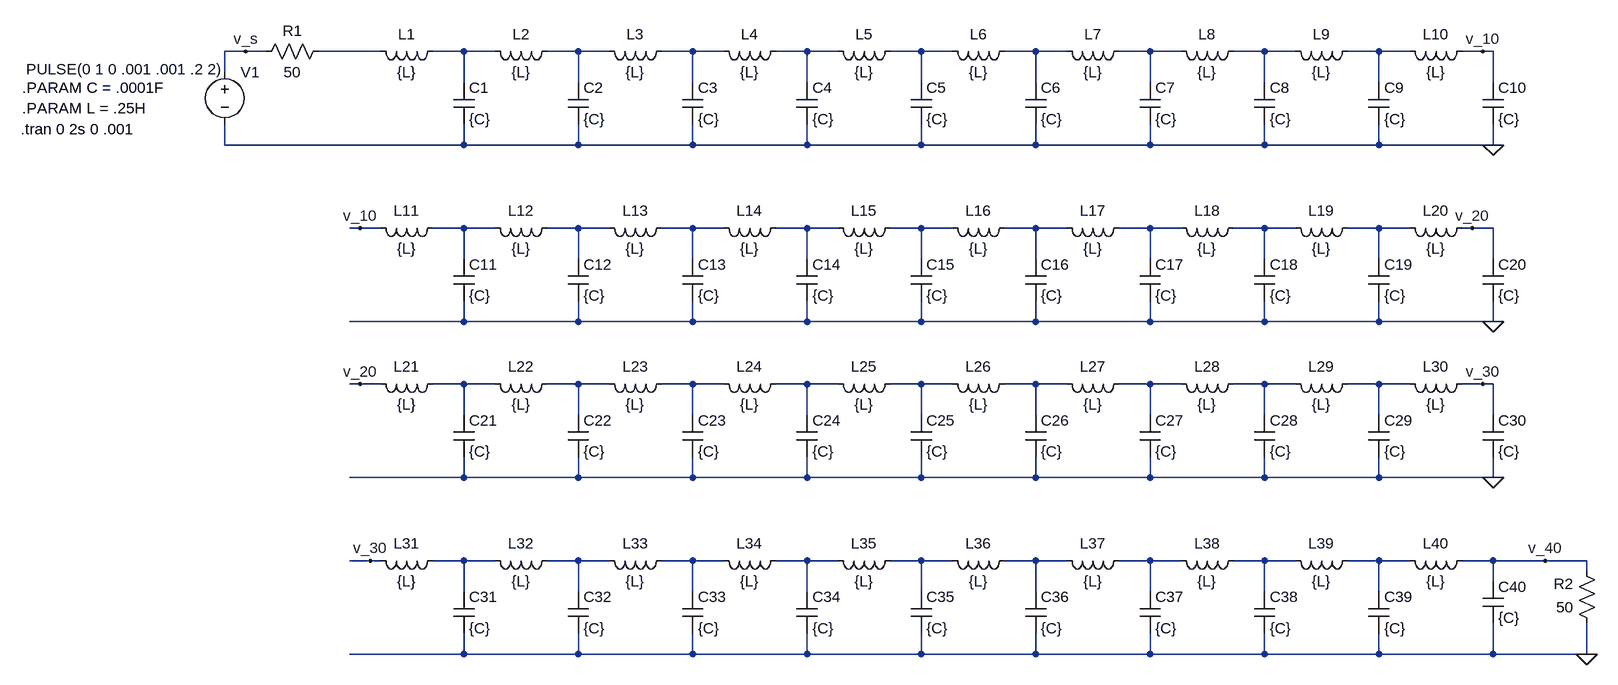
[diagram p0: schematic Schematic.asc]
Schematic.asc, the LTspice schematic file:
Version 4
SHEET 1 1844 1016
WIRE -240 48 -272 48
WIRE -208 48 -240 48
WIRE -32 48 -128 48
WIRE 96 48 48 48
WIRE 144 48 96 48
WIRE 272 48 224 48
WIRE 320 48 272 48
WIRE 448 48 400 48
WIRE 496 48 448 48
WIRE 624 48 576 48
WIRE 672 48 624 48
WIRE 800 48 752 48
WIRE 848 48 800 48
WIRE 976 48 928 48
WIRE 1024 48 976 48
WIRE 1152 48 1104 48
WIRE 1200 48 1152 48
WIRE 1328 48 1280 48
WIRE 1376 48 1328 48
WIRE 1504 48 1456 48
WIRE 1552 48 1504 48
WIRE 1664 48 1632 48
WIRE 1680 48 1664 48
WIRE -272 80 -272 48
WIRE 96 96 96 48
WIRE 272 96 272 48
WIRE 448 96 448 48
WIRE 624 96 624 48
WIRE 800 96 800 48
WIRE 976 96 976 48
WIRE 1152 96 1152 48
WIRE 1328 96 1328 48
WIRE 1504 96 1504 48
WIRE 1680 96 1680 48
WIRE -272 192 -272 160
WIRE 96 192 96 160
WIRE 96 192 -272 192
WIRE 272 192 272 160
WIRE 272 192 96 192
WIRE 448 192 448 160
WIRE 448 192 272 192
WIRE 624 192 624 160
WIRE 624 192 448 192
WIRE 800 192 800 160
WIRE 800 192 624 192
WIRE 976 192 976 160
WIRE 976 192 800 192
WIRE 1152 192 1152 160
WIRE 1152 192 976 192
WIRE 1328 192 1328 160
WIRE 1328 192 1152 192
WIRE 1504 192 1504 160
WIRE 1504 192 1328 192
WIRE 1680 192 1680 160
WIRE 1680 192 1504 192
WIRE -64 320 -80 320
WIRE -32 320 -64 320
WIRE 96 320 48 320
WIRE 144 320 96 320
WIRE 272 320 224 320
WIRE 320 320 272 320
WIRE 448 320 400 320
WIRE 496 320 448 320
WIRE 624 320 576 320
WIRE 672 320 624 320
WIRE 800 320 752 320
WIRE 848 320 800 320
WIRE 976 320 928 320
WIRE 1024 320 976 320
WIRE 1152 320 1104 320
WIRE 1200 320 1152 320
WIRE 1328 320 1280 320
WIRE 1376 320 1328 320
WIRE 1504 320 1456 320
WIRE 1552 320 1504 320
WIRE 1648 320 1632 320
WIRE 1680 320 1648 320
WIRE 96 368 96 320
WIRE 272 368 272 320
WIRE 448 368 448 320
WIRE 624 368 624 320
WIRE 800 368 800 320
WIRE 976 368 976 320
WIRE 1152 368 1152 320
WIRE 1328 368 1328 320
WIRE 1504 368 1504 320
WIRE 1680 368 1680 320
WIRE 96 464 96 432
WIRE 96 464 -80 464
WIRE 272 464 272 432
WIRE 272 464 96 464
WIRE 448 464 448 432
WIRE 448 464 272 464
WIRE 624 464 624 432
WIRE 624 464 448 464
WIRE 800 464 800 432
WIRE 800 464 624 464
WIRE 976 464 976 432
WIRE 976 464 800 464
WIRE 1152 464 1152 432
WIRE 1152 464 976 464
WIRE 1328 464 1328 432
WIRE 1328 464 1152 464
WIRE 1504 464 1504 432
WIRE 1504 464 1328 464
WIRE 1680 464 1680 432
WIRE 1680 464 1504 464
WIRE -64 560 -80 560
WIRE -32 560 -64 560
WIRE 96 560 48 560
WIRE 144 560 96 560
WIRE 272 560 224 560
WIRE 320 560 272 560
WIRE 448 560 400 560
WIRE 496 560 448 560
WIRE 624 560 576 560
WIRE 672 560 624 560
WIRE 800 560 752 560
WIRE 848 560 800 560
WIRE 976 560 928 560
WIRE 1024 560 976 560
WIRE 1152 560 1104 560
WIRE 1200 560 1152 560
WIRE 1328 560 1280 560
WIRE 1376 560 1328 560
WIRE 1504 560 1456 560
WIRE 1552 560 1504 560
WIRE 1664 560 1632 560
WIRE 1680 560 1664 560
WIRE 96 608 96 560
WIRE 272 608 272 560
WIRE 448 608 448 560
WIRE 624 608 624 560
WIRE 800 608 800 560
WIRE 976 608 976 560
WIRE 1152 608 1152 560
WIRE 1328 608 1328 560
WIRE 1504 608 1504 560
WIRE 1680 608 1680 560
WIRE 96 704 96 672
WIRE 96 704 -80 704
WIRE 272 704 272 672
WIRE 272 704 96 704
WIRE 448 704 448 672
WIRE 448 704 272 704
WIRE 624 704 624 672
WIRE 624 704 448 704
WIRE 800 704 800 672
WIRE 800 704 624 704
WIRE 976 704 976 672
WIRE 976 704 800 704
WIRE 1152 704 1152 672
WIRE 1152 704 976 704
WIRE 1328 704 1328 672
WIRE 1328 704 1152 704
WIRE 1504 704 1504 672
WIRE 1504 704 1328 704
WIRE 1680 704 1680 672
WIRE 1680 704 1504 704
WIRE -48 832 -80 832
WIRE -32 832 -48 832
WIRE 96 832 48 832
WIRE 144 832 96 832
WIRE 272 832 224 832
WIRE 320 832 272 832
WIRE 448 832 400 832
WIRE 496 832 448 832
WIRE 624 832 576 832
WIRE 672 832 624 832
WIRE 800 832 752 832
WIRE 848 832 800 832
WIRE 976 832 928 832
WIRE 1024 832 976 832
WIRE 1152 832 1104 832
WIRE 1200 832 1152 832
WIRE 1328 832 1280 832
WIRE 1376 832 1328 832
WIRE 1504 832 1456 832
WIRE 1552 832 1504 832
WIRE 1680 832 1632 832
WIRE 1760 832 1680 832
WIRE 1824 832 1760 832
WIRE 1824 848 1824 832
WIRE 1680 864 1680 832
WIRE 96 880 96 832
WIRE 272 880 272 832
WIRE 448 880 448 832
WIRE 624 880 624 832
WIRE 800 880 800 832
WIRE 976 880 976 832
WIRE 1152 880 1152 832
WIRE 1328 880 1328 832
WIRE 1504 880 1504 832
WIRE 96 976 96 944
WIRE 96 976 -80 976
WIRE 272 976 272 944
WIRE 272 976 96 976
WIRE 448 976 448 944
WIRE 448 976 272 976
WIRE 624 976 624 944
WIRE 624 976 448 976
WIRE 800 976 800 944
WIRE 800 976 624 976
WIRE 976 976 976 944
WIRE 976 976 800 976
WIRE 1152 976 1152 944
WIRE 1152 976 976 976
WIRE 1328 976 1328 944
WIRE 1328 976 1152 976
WIRE 1504 976 1504 944
WIRE 1504 976 1328 976
WIRE 1680 976 1680 928
WIRE 1680 976 1504 976
WIRE 1824 976 1824 928
WIRE 1824 976 1680 976
FLAG 1680 192 0
FLAG 1680 464 0
FLAG 1680 704 0
FLAG 1824 976 0
FLAG -240 48 v_s
FLAG 1664 48 v_10
FLAG -64 320 v_10
FLAG 1648 320 v_20
FLAG -64 560 v_20
FLAG 1664 560 v_30
FLAG -48 832 v_30
FLAG 1760 832 v_40
SYMBOL ind 64 32 R90
WINDOW 0 5 56 VBottom 2
WINDOW 3 32 56 VTop 2
SYMATTR InstName L1
SYMATTR Value {L}
SYMBOL cap 80 96 R0
SYMATTR InstName C1
SYMATTR Value {C}
SYMBOL ind 240 32 R90
WINDOW 0 5 56 VBottom 2
WINDOW 3 32 56 VTop 2
SYMATTR InstName L2
SYMATTR Value {L}
SYMBOL cap 256 96 R0
SYMATTR InstName C2
SYMATTR Value {C}
SYMBOL ind 416 32 R90
WINDOW 0 5 56 VBottom 2
WINDOW 3 32 56 VTop 2
SYMATTR InstName L3
SYMATTR Value {L}
SYMBOL cap 432 96 R0
SYMATTR InstName C3
SYMATTR Value {C}
SYMBOL ind 592 32 R90
WINDOW 0 5 56 VBottom 2
WINDOW 3 32 56 VTop 2
SYMATTR InstName L4
SYMATTR Value {L}
SYMBOL cap 608 96 R0
SYMATTR InstName C4
SYMATTR Value {C}
SYMBOL ind 768 32 R90
WINDOW 0 5 56 VBottom 2
WINDOW 3 32 56 VTop 2
SYMATTR InstName L5
SYMATTR Value {L}
SYMBOL cap 784 96 R0
SYMATTR InstName C5
SYMATTR Value {C}
SYMBOL ind 944 32 R90
WINDOW 0 5 56 VBottom 2
WINDOW 3 32 56 VTop 2
SYMATTR InstName L6
SYMATTR Value {L}
SYMBOL cap 960 96 R0
SYMATTR InstName C6
SYMATTR Value {C}
SYMBOL ind 1120 32 R90
WINDOW 0 5 56 VBottom 2
WINDOW 3 32 56 VTop 2
SYMATTR InstName L7
SYMATTR Value {L}
SYMBOL cap 1136 96 R0
SYMATTR InstName C7
SYMATTR Value {C}
SYMBOL ind 1296 32 R90
WINDOW 0 5 56 VBottom 2
WINDOW 3 32 56 VTop 2
SYMATTR InstName L8
SYMATTR Value {L}
SYMBOL cap 1312 96 R0
SYMATTR InstName C8
SYMATTR Value {C}
SYMBOL ind 1472 32 R90
WINDOW 0 5 56 VBottom 2
WINDOW 3 32 56 VTop 2
SYMATTR InstName L9
SYMATTR Value {L}
SYMBOL cap 1488 96 R0
SYMATTR InstName C9
SYMATTR Value {C}
SYMBOL ind 1648 32 R90
WINDOW 0 5 56 VBottom 2
WINDOW 3 32 56 VTop 2
SYMATTR InstName L10
SYMATTR Value {L}
SYMBOL cap 1664 96 R0
SYMATTR InstName C10
SYMATTR Value {C}
SYMBOL ind 64 304 R90
WINDOW 0 5 56 VBottom 2
WINDOW 3 32 56 VTop 2
SYMATTR InstName L11
SYMATTR Value {L}
SYMBOL cap 80 368 R0
SYMATTR InstName C11
SYMATTR Value {C}
SYMBOL ind 240 304 R90
WINDOW 0 5 56 VBottom 2
WINDOW 3 32 56 VTop 2
SYMATTR InstName L12
SYMATTR Value {L}
SYMBOL cap 256 368 R0
SYMATTR InstName C12
SYMATTR Value {C}
SYMBOL ind 416 304 R90
WINDOW 0 5 56 VBottom 2
WINDOW 3 32 56 VTop 2
SYMATTR InstName L13
SYMATTR Value {L}
SYMBOL cap 432 368 R0
SYMATTR InstName C13
SYMATTR Value {C}
SYMBOL ind 592 304 R90
WINDOW 0 5 56 VBottom 2
WINDOW 3 32 56 VTop 2
SYMATTR InstName L14
SYMATTR Value {L}
SYMBOL cap 608 368 R0
SYMATTR InstName C14
SYMATTR Value {C}
SYMBOL ind 768 304 R90
WINDOW 0 5 56 VBottom 2
WINDOW 3 32 56 VTop 2
SYMATTR InstName L15
SYMATTR Value {L}
SYMBOL cap 784 368 R0
SYMATTR InstName C15
SYMATTR Value {C}
SYMBOL ind 944 304 R90
WINDOW 0 5 56 VBottom 2
WINDOW 3 32 56 VTop 2
SYMATTR InstName L16
SYMATTR Value {L}
SYMBOL cap 960 368 R0
SYMATTR InstName C16
SYMATTR Value {C}
SYMBOL ind 1120 304 R90
WINDOW 0 5 56 VBottom 2
WINDOW 3 32 56 VTop 2
SYMATTR InstName L17
SYMATTR Value {L}
SYMBOL cap 1136 368 R0
SYMATTR InstName C17
SYMATTR Value {C}
SYMBOL ind 1296 304 R90
WINDOW 0 5 56 VBottom 2
WINDOW 3 32 56 VTop 2
SYMATTR InstName L18
SYMATTR Value {L}
SYMBOL cap 1312 368 R0
SYMATTR InstName C18
SYMATTR Value {C}
SYMBOL ind 1472 304 R90
WINDOW 0 5 56 VBottom 2
WINDOW 3 32 56 VTop 2
SYMATTR InstName L19
SYMATTR Value {L}
SYMBOL cap 1488 368 R0
SYMATTR InstName C19
SYMATTR Value {C}
SYMBOL ind 1648 304 R90
WINDOW 0 5 56 VBottom 2
WINDOW 3 32 56 VTop 2
SYMATTR InstName L20
SYMATTR Value {L}
SYMBOL cap 1664 368 R0
SYMATTR InstName C20
SYMATTR Value {C}
SYMBOL ind 64 544 R90
WINDOW 0 5 56 VBottom 2
WINDOW 3 32 56 VTop 2
SYMATTR InstName L21
SYMATTR Value {L}
SYMBOL cap 80 608 R0
SYMATTR InstName C21
SYMATTR Value {C}
SYMBOL ind 240 544 R90
WINDOW 0 5 56 VBottom 2
WINDOW 3 32 56 VTop 2
SYMATTR InstName L22
SYMATTR Value {L}
SYMBOL cap 256 608 R0
SYMATTR InstName C22
SYMATTR Value {C}
SYMBOL ind 416 544 R90
WINDOW 0 5 56 VBottom 2
WINDOW 3 32 56 VTop 2
SYMATTR InstName L23
SYMATTR Value {L}
SYMBOL cap 432 608 R0
SYMATTR InstName C23
SYMATTR Value {C}
SYMBOL ind 592 544 R90
WINDOW 0 5 56 VBottom 2
WINDOW 3 32 56 VTop 2
SYMATTR InstName L24
SYMATTR Value {L}
SYMBOL cap 608 608 R0
SYMATTR InstName C24
SYMATTR Value {C}
SYMBOL ind 768 544 R90
WINDOW 0 5 56 VBottom 2
WINDOW 3 32 56 VTop 2
SYMATTR InstName L25
SYMATTR Value {L}
SYMBOL cap 784 608 R0
SYMATTR InstName C25
SYMATTR Value {C}
SYMBOL ind 944 544 R90
WINDOW 0 5 56 VBottom 2
WINDOW 3 32 56 VTop 2
SYMATTR InstName L26
SYMATTR Value {L}
SYMBOL cap 960 608 R0
SYMATTR InstName C26
SYMATTR Value {C}
SYMBOL ind 1120 544 R90
WINDOW 0 5 56 VBottom 2
WINDOW 3 32 56 VTop 2
SYMATTR InstName L27
SYMATTR Value {L}
SYMBOL cap 1136 608 R0
SYMATTR InstName C27
SYMATTR Value {C}
SYMBOL ind 1296 544 R90
WINDOW 0 5 56 VBottom 2
WINDOW 3 32 56 VTop 2
SYMATTR InstName L28
SYMATTR Value {L}
SYMBOL cap 1312 608 R0
SYMATTR InstName C28
SYMATTR Value {C}
SYMBOL ind 1472 544 R90
WINDOW 0 5 56 VBottom 2
WINDOW 3 32 56 VTop 2
SYMATTR InstName L29
SYMATTR Value {L}
SYMBOL cap 1488 608 R0
SYMATTR InstName C29
SYMATTR Value {C}
SYMBOL ind 1648 544 R90
WINDOW 0 5 56 VBottom 2
WINDOW 3 32 56 VTop 2
SYMATTR InstName L30
SYMATTR Value {L}
SYMBOL cap 1664 608 R0
SYMATTR InstName C30
SYMATTR Value {C}
SYMBOL ind 64 816 R90
WINDOW 0 5 56 VBottom 2
WINDOW 3 32 56 VTop 2
SYMATTR InstName L31
SYMATTR Value {L}
SYMBOL cap 80 880 R0
SYMATTR InstName C31
SYMATTR Value {C}
SYMBOL ind 240 816 R90
WINDOW 0 5 56 VBottom 2
WINDOW 3 32 56 VTop 2
SYMATTR InstName L32
SYMATTR Value {L}
SYMBOL cap 256 880 R0
SYMATTR InstName C32
SYMATTR Value {C}
SYMBOL ind 416 816 R90
WINDOW 0 5 56 VBottom 2
WINDOW 3 32 56 VTop 2
SYMATTR InstName L33
SYMATTR Value {L}
SYMBOL cap 432 880 R0
SYMATTR InstName C33
SYMATTR Value {C}
SYMBOL ind 592 816 R90
WINDOW 0 5 56 VBottom 2
WINDOW 3 32 56 VTop 2
SYMATTR InstName L34
SYMATTR Value {L}
SYMBOL cap 608 880 R0
SYMATTR InstName C34
SYMATTR Value {C}
SYMBOL ind 768 816 R90
WINDOW 0 5 56 VBottom 2
WINDOW 3 32 56 VTop 2
SYMATTR InstName L35
SYMATTR Value {L}
SYMBOL cap 784 880 R0
SYMATTR InstName C35
SYMATTR Value {C}
SYMBOL ind 944 816 R90
WINDOW 0 5 56 VBottom 2
WINDOW 3 32 56 VTop 2
SYMATTR InstName L36
SYMATTR Value {L}
SYMBOL cap 960 880 R0
SYMATTR InstName C36
SYMATTR Value {C}
SYMBOL ind 1120 816 R90
WINDOW 0 5 56 VBottom 2
WINDOW 3 32 56 VTop 2
SYMATTR InstName L37
SYMATTR Value {L}
SYMBOL cap 1136 880 R0
SYMATTR InstName C37
SYMATTR Value {C}
SYMBOL ind 1296 816 R90
WINDOW 0 5 56 VBottom 2
WINDOW 3 32 56 VTop 2
SYMATTR InstName L38
SYMATTR Value {L}
SYMBOL cap 1312 880 R0
SYMATTR InstName C38
SYMATTR Value {C}
SYMBOL ind 1472 816 R90
WINDOW 0 5 56 VBottom 2
WINDOW 3 32 56 VTop 2
SYMATTR InstName L39
SYMATTR Value {L}
SYMBOL cap 1488 880 R0
SYMATTR InstName C39
SYMATTR Value {C}
SYMBOL ind 1648 816 R90
WINDOW 0 5 56 VBottom 2
WINDOW 3 32 56 VTop 2
SYMATTR InstName L40
SYMATTR Value {L}
SYMBOL res -112 32 R90
WINDOW 0 0 56 VBottom 2
WINDOW 3 32 56 VTop 2
SYMATTR InstName R1
SYMATTR Value 50
SYMBOL cap 1664 864 R0
SYMATTR InstName C40
SYMATTR Value {C}
SYMBOL res 1840 944 R180
WINDOW 0 36 76 Left 2
WINDOW 3 36 40 Left 2
SYMATTR InstName R2
SYMATTR Value 50
SYMBOL voltage -272 64 R0
WINDOW 3 -306 11 Left 2
WINDOW 123 0 0 Left 2
WINDOW 39 0 0 Left 2
SYMATTR InstName V1
SYMATTR Value PULSE(0 1 0 .001 .001 .2 2)
TEXT -584 104 Left 2 !.PARAM C = .0001F\n.PARAM L = .25H
TEXT -586 168 Left 2 !.tran 0 2s 0 .001

The netlist it stands for:
* Schematic.asc
L1 N002 N001 {L}
C1 N002 0 {C}
L2 N003 N002 {L}
C2 N003 0 {C}
L3 N004 N003 {L}
C3 N004 0 {C}
L4 N005 N004 {L}
C4 N005 0 {C}
L5 N006 N005 {L}
C5 N006 0 {C}
L6 N007 N006 {L}
C6 N007 0 {C}
L7 N008 N007 {L}
C7 N008 0 {C}
L8 N009 N008 {L}
C8 N009 0 {C}
L9 N010 N009 {L}
C9 N010 0 {C}
L10 v_10 N010 {L}
C10 v_10 0 {C}
L11 N011 v_10 {L}
C11 N011 0 {C}
L12 N012 N011 {L}
C12 N012 0 {C}
L13 N013 N012 {L}
C13 N013 0 {C}
L14 N014 N013 {L}
C14 N014 0 {C}
L15 N015 N014 {L}
C15 N015 0 {C}
L16 N016 N015 {L}
C16 N016 0 {C}
L17 N017 N016 {L}
C17 N017 0 {C}
L18 N018 N017 {L}
C18 N018 0 {C}
L19 N019 N018 {L}
C19 N019 0 {C}
L20 v_20 N019 {L}
C20 v_20 0 {C}
L21 N020 v_20 {L}
C21 N020 0 {C}
L22 N021 N020 {L}
C22 N021 0 {C}
L23 N022 N021 {L}
C23 N022 0 {C}
L24 N023 N022 {L}
C24 N023 0 {C}
L25 N024 N023 {L}
C25 N024 0 {C}
L26 N025 N024 {L}
C26 N025 0 {C}
L27 N026 N025 {L}
C27 N026 0 {C}
L28 N027 N026 {L}
C28 N027 0 {C}
L29 N028 N027 {L}
C29 N028 0 {C}
L30 v_30 N028 {L}
C30 v_30 0 {C}
L31 N029 v_30 {L}
C31 N029 0 {C}
L32 N030 N029 {L}
C32 N030 0 {C}
L33 N031 N030 {L}
C33 N031 0 {C}
L34 N032 N031 {L}
C34 N032 0 {C}
L35 N033 N032 {L}
C35 N033 0 {C}
L36 N034 N033 {L}
C36 N034 0 {C}
L37 N035 N034 {L}
C37 N035 0 {C}
L38 N036 N035 {L}
C38 N036 0 {C}
L39 N037 N036 {L}
C39 N037 0 {C}
L40 v_40 N037 {L}
R1 N001 v_s 50
C40 v_40 0 {C}
R2 0 v_40 50
V1 v_s 0 PULSE(0 1 0 .001 .001 .2 2)
.PARAM C = .0001F
.PARAM L = .25H
.tran 0 2s 0 .001
.backanno
.end